# EAGLE design 76x40 LED BOB (EAGLE 9.6.2)
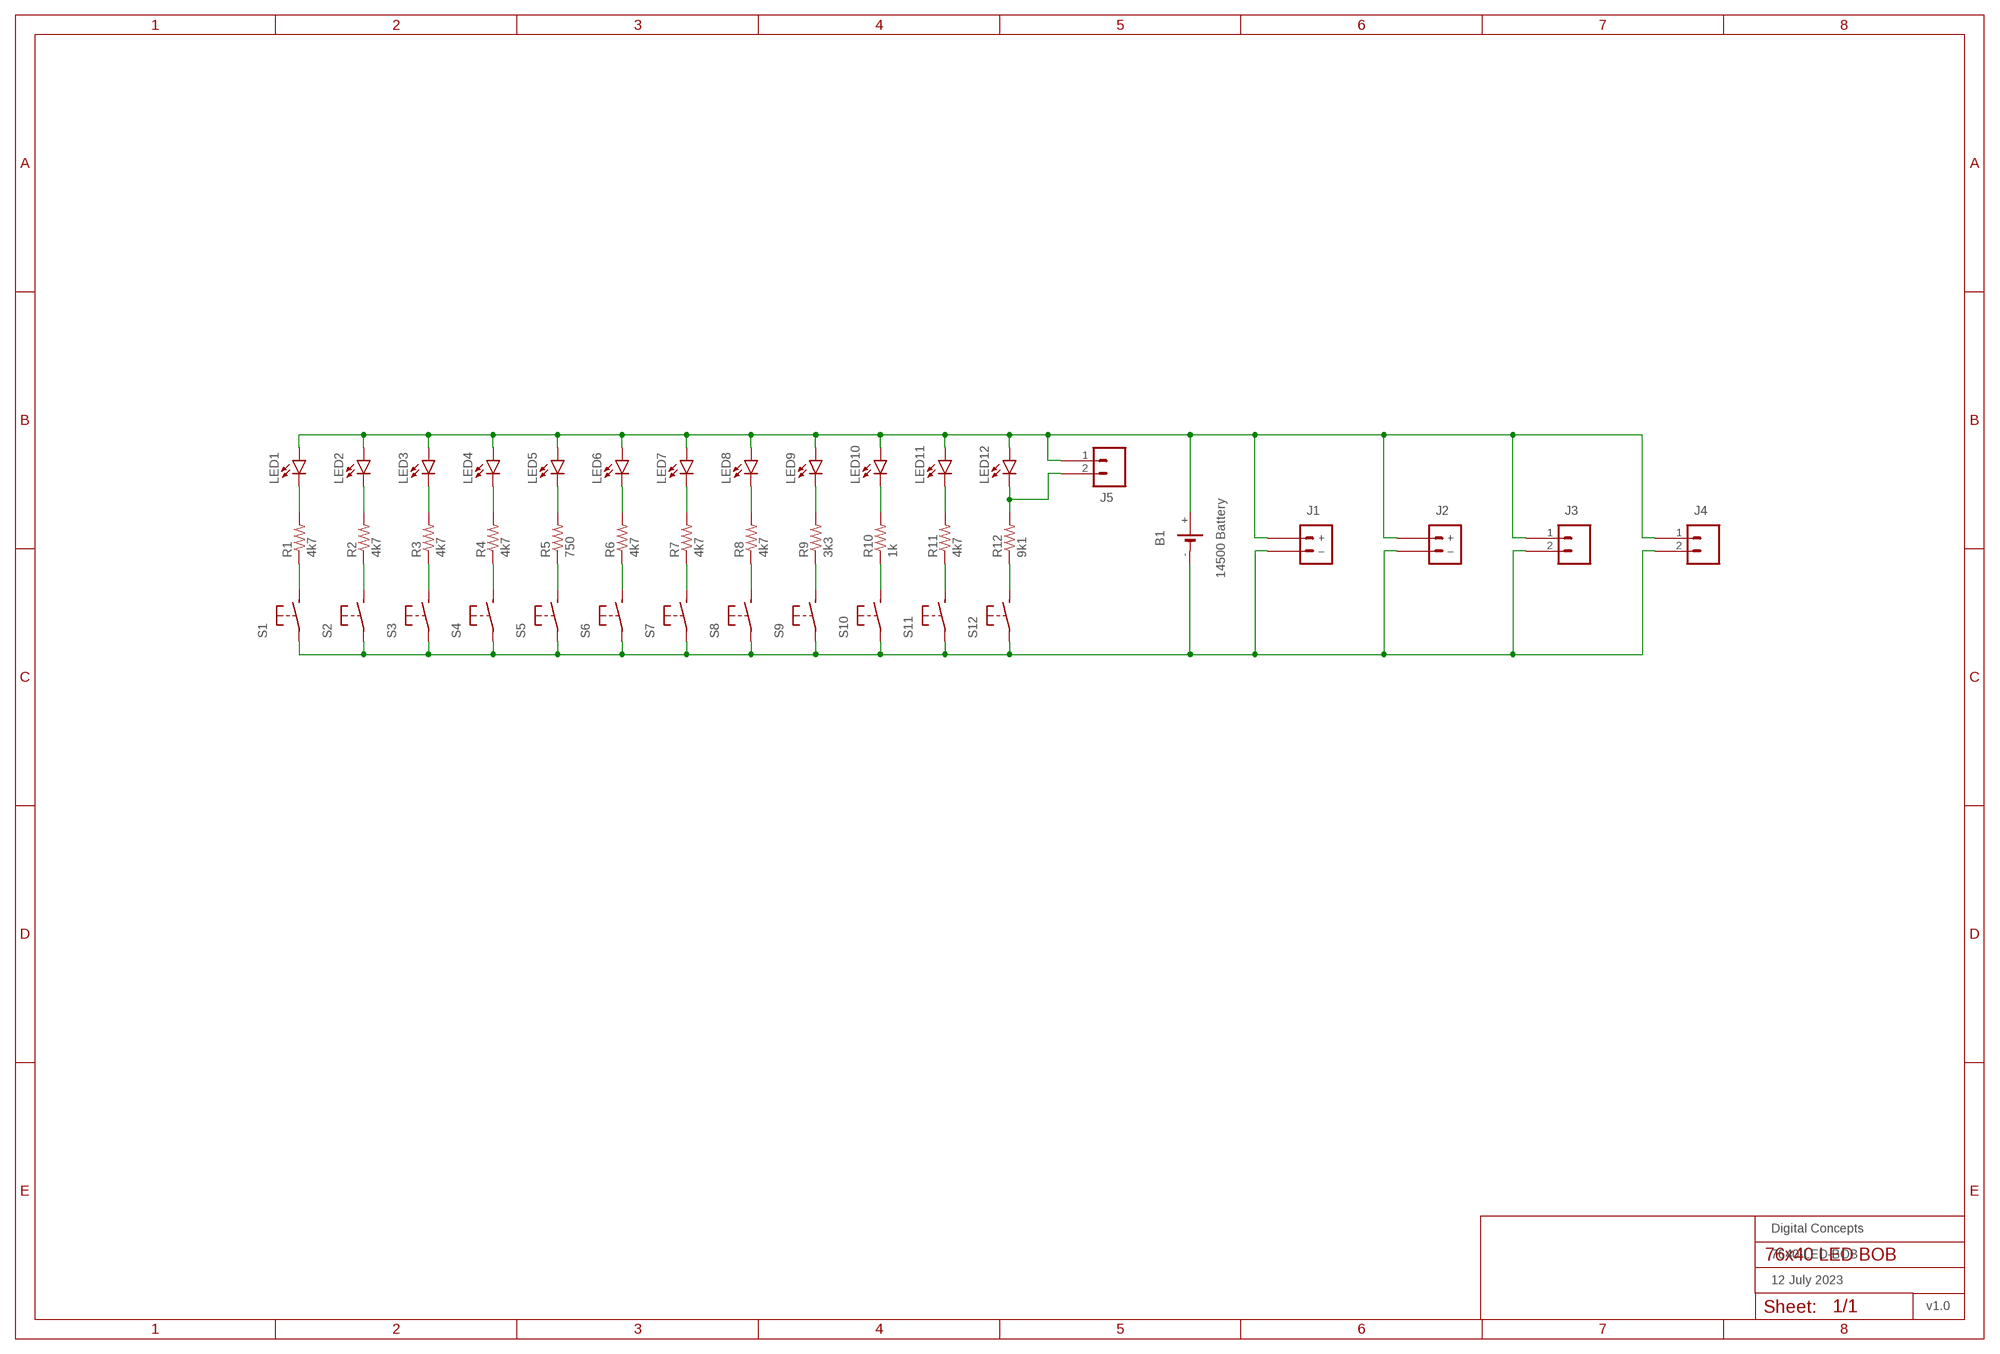
[diagram p0: schematic, sheet 1]
FRAME1 (FRAME-A3L-LOC): DATE: 12 July 2023; OWNER: Digital Concepts; TITLE: 7640-LED-BOB; VERSION: v1.0

## Parts
B1  14500 Battery  BATTERY-HOLDER-14500(AA)  [BATTERY-14500]
J1  JST-PH2.0-2-H-POWER  [JST-PH2.0-2-HORIZONTAL-POWER]
J2  JST-GH1.25-2-HORIZONTAL-POWER  [JST-GH1.25-2-HORIZONTAL]
J3  HEADER-1X2-GENERIC  [CONN_02-GENERIC]
J4  HEADER-1X2-GENERIC  [CONN_02-GENERIC]
J5  HEADER-1X2-GENERIC  [CONN_02-GENERIC]
LED1  LEDCHIP-LED0805  [CHIP-LED0805]
LED2  LEDCHIP-LED0805  [CHIP-LED0805]
LED3  LEDCHIP-LED0805  [CHIP-LED0805]
LED4  LEDCHIP-LED0805  [CHIP-LED0805]
LED5  LEDCHIP-LED0805  [CHIP-LED0805]
LED6  LEDCHIP-LED0805  [CHIP-LED0805]
LED7  LEDCHIP-LED0805  [CHIP-LED0805]
LED8  LEDCHIP-LED0805  [CHIP-LED0805]
LED9  LEDCHIP-LED0805  [CHIP-LED0805]
LED10  LEDCHIP-LED0805  [CHIP-LED0805]
LED11  LEDCHIP-LED0805  [CHIP-LED0805]
LED12  LEDCHIP-LED0805  [CHIP-LED0805]
R1  4k7  RESISTORR0805  [R0805]
R2  4k7  RESISTORR0805  [R0805]
R3  4k7  RESISTORR0805  [R0805]
R4  4k7  RESISTORR0805  [R0805]
R5  750  RESISTORR0805  [R0805]
R6  4k7  RESISTORR0805  [R0805]
R7  4k7  RESISTORR0805  [R0805]
R8  4k7  RESISTORR0805  [R0805]
R9  3k3  RESISTORR0805  [R0805]
R10  1k  RESISTORR0805  [R0805]
R11  4k7  RESISTORR0805  [R0805]
R12  9k1  RESISTORR0805  [R0805]
S1  SWITCH-MOMENTARY-2-PIN  [SWITCH-2-PAD]
S2  SWITCH-MOMENTARY-2-PIN  [SWITCH-2-PAD]
S3  SWITCH-MOMENTARY-2-PIN  [SWITCH-2-PAD]
S4  SWITCH-MOMENTARY-2-PIN  [SWITCH-2-PAD]
S5  SWITCH-MOMENTARY-2-PIN  [SWITCH-2-PAD]
S6  SWITCH-MOMENTARY-2-PIN  [SWITCH-2-PAD]
S7  SWITCH-MOMENTARY-2-PIN  [SWITCH-2-PAD]
S8  SWITCH-MOMENTARY-2-PIN  [SWITCH-2-PAD]
S9  SWITCH-MOMENTARY-2-PIN  [SWITCH-2-PAD]
S10  SWITCH-MOMENTARY-2-PIN  [SWITCH-2-PAD]
S11  SWITCH-MOMENTARY-2-PIN  [SWITCH-2-PAD]
S12  SWITCH-MOMENTARY-2-PIN  [SWITCH-2-PAD]

## Nets
N$1: LED1.C R1.2
N$2: R1.1 S1.P$2(S)
N$4: J5.2 LED12.C R12.2
N$5: LED2.C R2.2
N$6: R2.1 S2.P$2(S)
N$9: LED3.C R3.2
N$10: R3.1 S3.P$2(S)
N$13: LED4.C R4.2
N$14: R4.1 S4.P$2(S)
N$17: LED5.C R5.2
N$18: R5.1 S5.P$2(S)
N$21: LED6.C R6.2
N$22: R6.1 S6.P$2(S)
N$25: LED7.C R7.2
N$26: R7.1 S7.P$2(S)
N$29: LED8.C R8.2
N$30: R8.1 S8.P$2(S)
N$33: LED9.C R9.2
N$34: R9.1 S9.P$2(S)
N$37: LED10.C R10.2
N$38: R10.1 S10.P$2(S)
N$41: LED11.C R11.2
N$42: R11.1 S11.P$2(S)
N$46: R12.1 S12.P$2(S)
N$49: B1.+ J1.+ J2.+ J3.1 J4.1 J5.1 LED1.A LED2.A LED3.A LED4.A LED5.A LED6.A LED7.A LED8.A LED9.A LED10.A LED11.A LED12.A
N$50: B1.- J1.-(–) J2.-(–) J3.2 J4.2 S1.P$1(P) S2.P$1(P) S3.P$1(P) S4.P$1(P) S5.P$1(P) S6.P$1(P) S7.P$1(P) S8.P$1(P) S9.P$1(P) S10.P$1(P) S11.P$1(P) S12.P$1(P)

## Library data of the parts
B1 = digitalconcepts:BATTERY-HOLDER-14500(AA): 14500 (AA) battery holder
J1 = digitalconcepts:JST-PH2.0-2-H-POWER: JST PH2.0 2P Right Angle Connector with power pin labelling
J2 = digitalconcepts:JST-GH1.25-2-HORIZONTAL-POWER: JST GH1.25 2P PTH Connector (Power)
J3-J5 = digitalconcepts:HEADER-1X2-GENERIC: Single Row 2-Pin Header
LED1-LED12 = digitalconcepts:LED: LED OSRAM: - CHIPLED LG R971, LG N971, LY N971, LG Q971, LY Q971, LO R971, LY R971 LH N974, LH R974 LS Q976, LO Q976, LY Q976 LO Q996 - Hyper CHIPLED LW Q18S LB Q993, LB Q99A, LB R99A - SideLED LS A670, LO A670, LY A670, LG A670, LP A670 LB A673, LV A673, LT A673, LW A673 LH A674 LY A675 LS A676, LA A676, LO A676, LY A676, LW A676 LS A679, LY A679, LG A679 - Hyper Micro SIDELED® LS Y876, LA Y876, LO Y876, LY Y876 LT Y87S - SmartLED LW L88C, LW L88S LB L89C, LB L89S, LG L890 LS L89K, LO L89K, LY L89K LS L896, LA L896, LO L896, LY L896 - TOPLED LS T670, LO T670, LY T670, LG T670, LP T670 LSG T670, LSP T670, LSY T670, LOP T670, LYG T670 LG T671, LOG T671, LSG T671 LB T673, LV T673, LT T673, LW T673 LH T674 LS T676, LA T676, LO T676, LY T676, LB T676, LH T676, LSB T676, LW T676 LB T67C, LV T67C, LT T67C, LS T67K, LO T67K, LY T67K, LW E67C LS E67B, LA E67B, LO E67B, LY E67B, LB E67C, LV E67C, LT E67C LW T67C LS T679, LY T679, LG T679 LS T770, LO T770, LY T770, LG T770, LP T770 LB T773, LV T773, LT T773, LW T773 LH T774 LS E675, LA E675, LY E675, LS T675 LS T776, LA T776, LO T776, LY T776, LB T776 LHGB T686 LT T68C, LB T68C - Hyper Mini TOPLED® LB M676 - Mini TOPLED Santana® LG M470 LS M47K, LO M47K, LY M47K Source: http://www.osram.convergy.de LUXEON: - LUMILED® LXK2-PW12-R00, LXK2-PW12-S00, LXK2-PW14-U00, LXK2-PW14-V00 LXK2-PM12-R00, LXK2-PM12-S00, LXK2-PM14-U00 LXK2-PE12-Q00, LXK2-PE12-R00, LXK2-PE12-S00, LXK2-PE14-T00, LXK2-PE14-U00 LXK2-PB12-K00, LXK2-PB12-L00, LXK2-PB12-M00, LXK2-PB14-N00, LXK2-PB14-P00, LXK2-PB14-Q00 LXK2-PR12-L00, LXK2-PR12-M00, LXK2-PR14-Q00, LXK2-PR14-R00 LXK2-PD12-Q00, LXK2-PD12-R00, LXK2-PD12-S00 LXK2-PH12-R00, LXK2-PH12-S00 LXK2-PL12-P00, LXK2-PL12-Q00, LXK2-PL12-R00 Source: www.luxeon.com KINGBRIGHT: KA-3528ASYC Source: www.kingbright.com
R1-R12 = digitalconcepts:RESISTOR: Resistor; SPICEPREFIX: R
S1-S12 = digitalconcepts:SWITCH-MOMENTARY-2-PIN: 2 Pin Momentary Switch

## Board
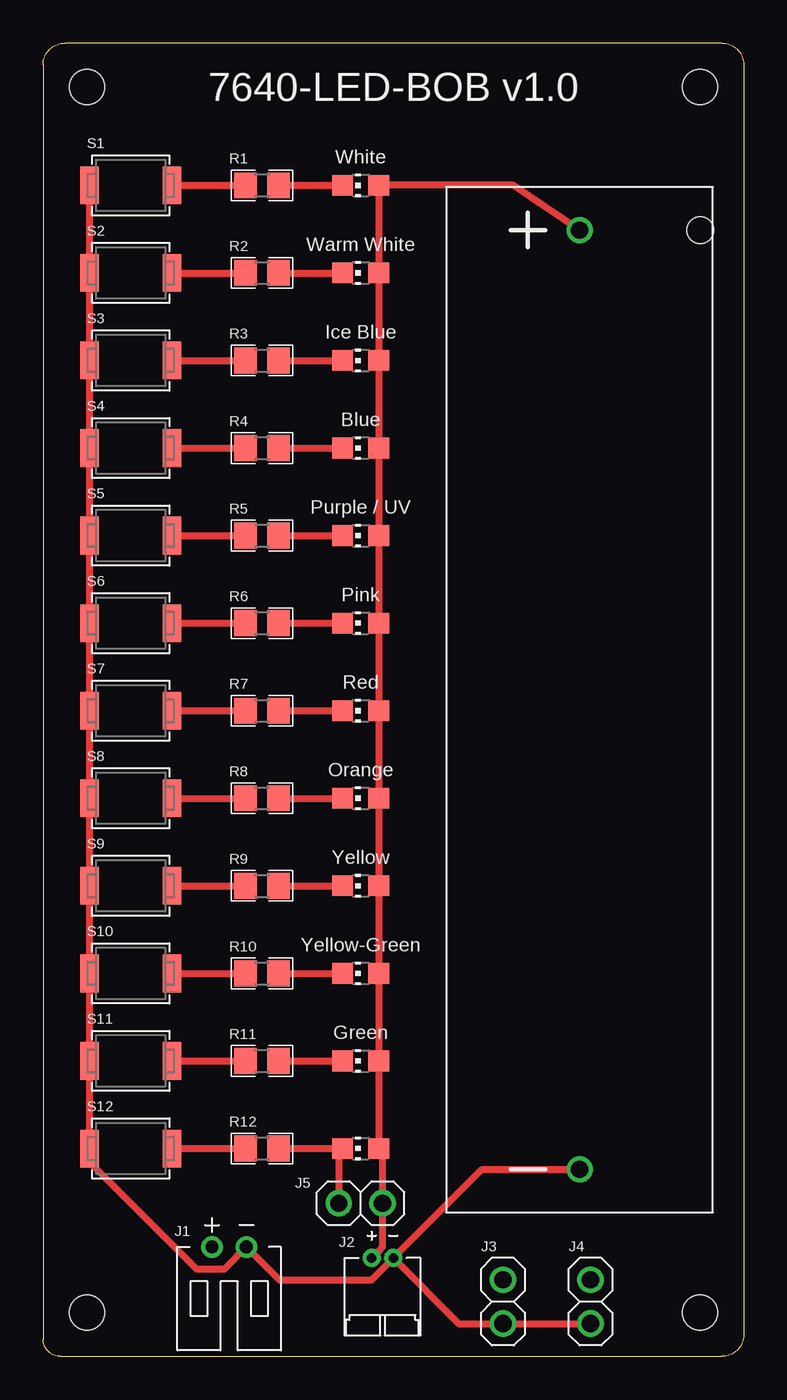
[diagram p1: board, top side]
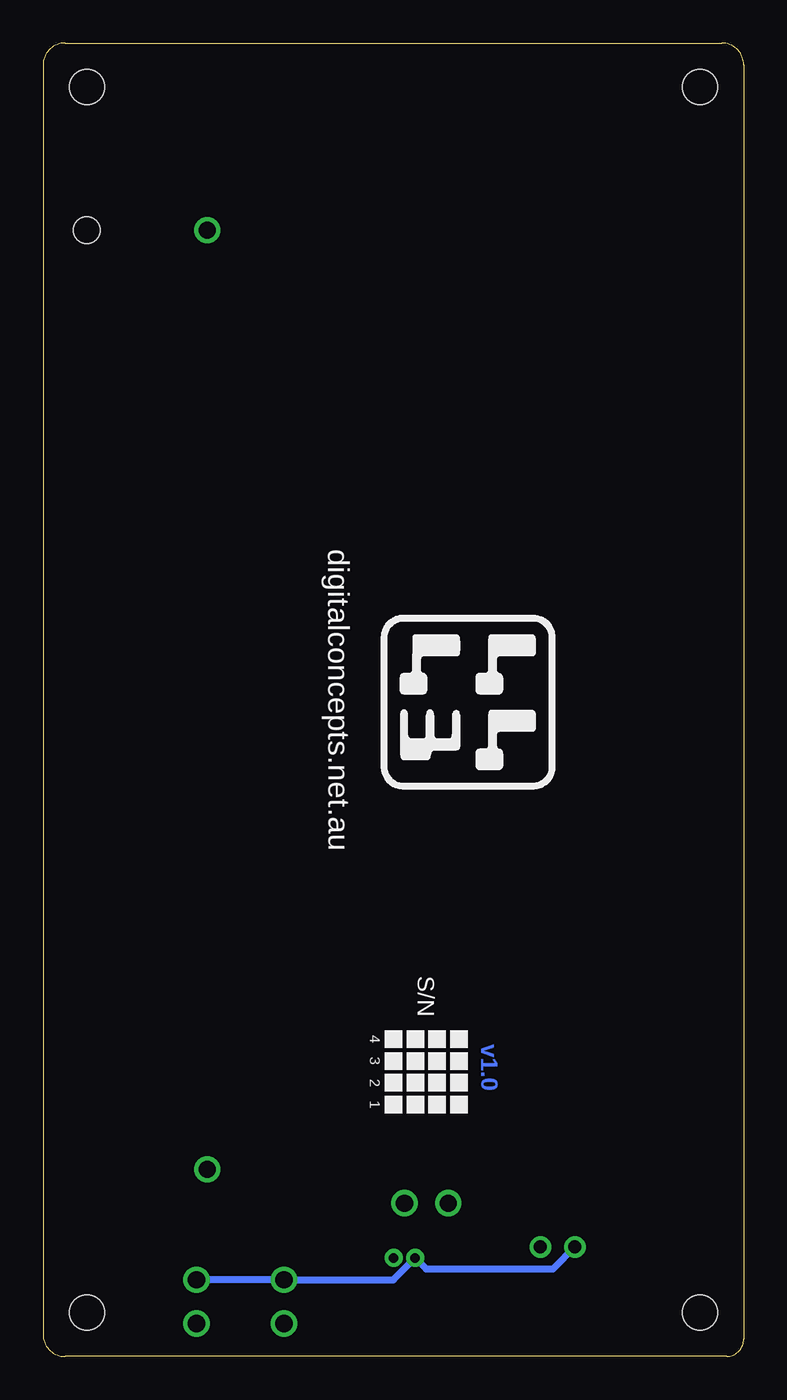
[diagram p2: board, bottom side, seen from below]

Size 40.64 x 76.2 mm. Coordinates in mm from the lower left corner, seen from the top.
Outline: 39.37,76.2 arc-90 40.64,74.93 40.64,1.27 arc-90 39.37,0 1,0 arc-90 0,1 0,74.93 arc-90 1.27,76.2 39.37,76.2
Copper layers (1*16): Top 0.035mm / dielectric 1.5mm / Bottom 0.035mm
Design rules "default *": minimum track width 6mil, minimum drill 0.35mm, track to track 6mil, track to pad 6mil, pad to pad 6mil, via to via 6mil, smd to smd 6mil, copper to edge 6mil, drill to drill 6mil, minimum pad ring 10mil, minimum via ring 8mil, stop-mask expansion 4mil, vias tented up to drill 0mil, thermal gap 0mil
Holes 2.03 mm at 2.54,73.66 2.54,2.54 38.1,2.54 38.1,73.66

### Footprints (pad centres in the part's own frame; a part is rotated, then mirrored left to right if it is on the bottom)
BATTERY-14500 = drill 1: + -27.25,0; - 27.25,0 | hole 1.524: -27.25,7
JST-PH2.0-2-HORIZONTAL-POWER = drill 0.75: + 1,0; - -1,0
JST-GH1.25-2-HORIZONTAL = drill 0.55 pad 1.016: + -0.625,0; - 0.625,0
CONN_02-GENERIC = drill 1 pad 1.524: 1 0,0; 2 2.54,0
CHIP-LED0805 = smd 1.2 x 1.2: A 0,-1.05; C 0,1.05
R0805 = smd 1.3 x 1.5: 1 -0.95,0; 2 0.95,0
SWITCH-2-PAD = smd 1.067 x 2.184: P$1 -2.4,0; P$2 2.4,0

### Placement (x,y rotation side)
B1  31.11,38.1 270 top
J1  10.79,6.35 180 top
J2  19.68,5.71 0 top
J3  26.67,4.45 270 top
J4  31.75,4.45 270 top
J5  19.68,8.89 180 top
LED1  18.41,67.94 90 top
LED2  18.41,62.87 90 top
LED3  18.41,57.78 90 top
LED4  18.41,52.7 90 top
LED5  18.41,47.62 90 top
LED6  18.41,42.55 90 top
LED7  18.41,37.47 90 top
LED8  18.41,32.38 90 top
LED9  18.41,27.3 90 top
LED10  18.41,22.23 90 top
LED11  18.41,17.14 90 top
LED12  18.41,12.06 90 top
R1  12.7,67.94 0 top
R2  12.7,62.87 0 top
R3  12.7,57.78 0 top
R4  12.7,52.7 0 top
R5  12.7,47.62 0 top
R6  12.7,42.55 0 top
R7  12.7,37.47 0 top
R8  12.7,32.38 0 top
R9  12.7,27.3 0 top
R10  12.7,22.23 0 top
R11  12.7,17.14 0 top
R12  12.7,12.06 0 top
S1  5.08,67.94 0 top
S2  5.08,62.87 0 top
S3  5.08,57.78 0 top
S4  5.08,52.7 0 top
S5  5.08,47.62 0 top
S6  5.08,42.55 0 top
S7  5.08,37.47 0 top
S8  5.08,32.38 0 top
S9  5.08,27.3 0 top
S10  5.08,22.23 0 top
S11  5.08,17.14 0 top
S12  5.08,12.06 0 top

### Tracks (layer width: path | path; a pad name or v marks a point on that pad's centre or on a via)
N$1
  Top 0.406: R1.2 LED1.C
N$2
  Top 0.406: S1.P$2 R1.1
N$4
  Top 0.406: R12.2 LED12.C 17.14,11.85 J5.2
N$5
  Top 0.406: R2.2 LED2.C
N$6
  Top 0.406: S2.P$2 R2.1
N$9
  Top 0.406: R3.2 LED3.C
N$10
  Top 0.406: S3.P$2 R3.1
N$13
  Top 0.406: R4.2 LED4.C
N$14
  Top 0.406: S4.P$2 R4.1
N$17
  Top 0.406: R5.2 LED5.C
N$18
  Top 0.406: S5.P$2 R5.1
N$21
  Top 0.406: R6.2 LED6.C
N$22
  Top 0.406: S6.P$2 R6.1
N$25
  Top 0.406: R7.2 LED7.C
N$26
  Top 0.406: S7.P$2 R7.1
N$29
  Top 0.406: R8.2 LED8.C
N$30
  Top 0.406: S8.P$2 R8.1
N$33
  Top 0.406: R9.2 LED9.C
N$34
  Top 0.406: S9.P$2 R9.1
N$37
  Top 0.406: R10.2 LED10.C
N$38
  Top 0.406: S10.P$2 R10.1
N$41
  Top 0.406: R11.2 LED11.C
N$42
  Top 0.406: S11.P$2 R11.1
N$46
  Top 0.406: S12.P$2 R12.1
N$49
  Top 0.406: B1.+ 27.28,67.94 LED1.A LED2.A LED3.A LED4.A LED5.A LED6.A LED7.A LED8.A LED9.A LED10.A LED11.A LED12.A 19.68,11.85 J5.1 19.68,6.34 19.43,6.08 J2.+
  Bottom 0.406: J1.+ 11.06,5.08 18.43,5.08 J2.+ 20.33,4.45 J3.1 J4.1
N$50
  Top 0.406: S1.P$1 S2.P$1 S3.P$1 S4.P$1 S5.P$1 S6.P$1 S7.P$1 S8.P$1 S9.P$1 S10.P$1 S11.P$1 S12.P$1 2.68,11.29 8.89,5.08 10.53,5.08 J1.- 13.7,4.45 19.05,4.45 J2.- | J2.- 25.45,10.85 B1.- | J2.- 24.12,1.91 J3.2 J4.2

### Text on the board
Bottom: v1.0
tPlace: 7640-LED-BOB v1.0 | White | Warm White | Ice Blue | Blue | Purple / UV | Pink | Red | Orange | Yellow | Yellow-Green | Green
bPlace: digitalconcepts.net.au | S/N | 4 | 3 | 2 | 1